# Altium schematic sheet MGNGSQ4_AC_Loopback.SchDoc
size A
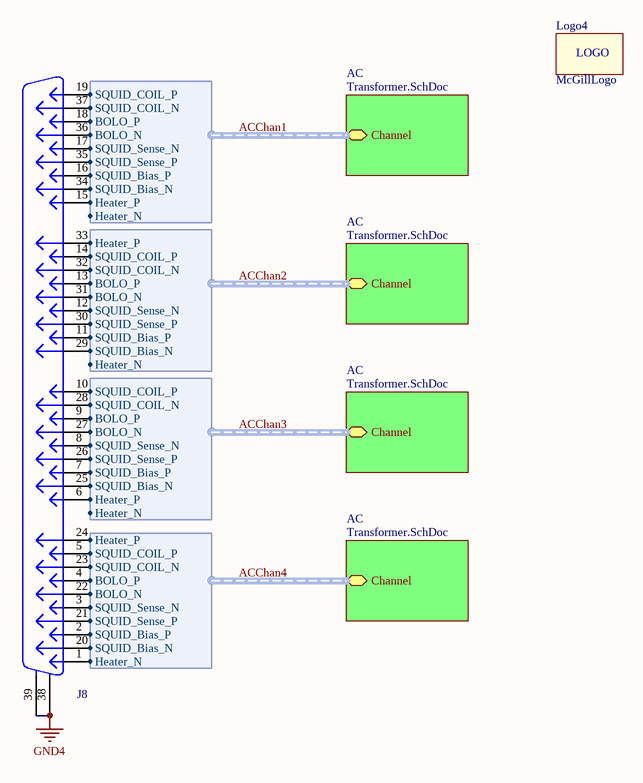
[diagram p0: MGNGSQ4_AC_Loopback.SchDoc]

## Parts
J8  DB37M  [DSUB37-M]  (value not drawn)
Logo4  McGillLogo  [McGillLogo1]  (no BOM)

## Sub-sheets
AC = Transformer.SchDoc: Channel (harness SQUID_CH_IN)
AC = Transformer.SchDoc: Channel (harness SQUID_CH_IN)
AC = Transformer.SchDoc: Channel (harness SQUID_CH_IN)
AC = Transformer.SchDoc: Channel (harness SQUID_CH_IN)

## Harnesses
SQUID_CH_IN: SQUID_COIL_P, SQUID_COIL_N, BOLO_P, BOLO_N, SQUID_Sense_P, SQUID_Bias_P, SQUID_Bias_N, Heater_P, SQUID_Sense_N, Heater_N

## Nets
GND4: J8.38(MH1) J8.39(MH2)
ACChan1.BOLO_N: J8.36 ; sheet AC/Channel.BOLO_N
ACChan1.BOLO_P: J8.18 ; sheet AC/Channel.BOLO_P
ACChan1.Heater_P: J8.15 ; sheet AC/Channel.Heater_P
ACChan1.SQUID_Bias_N: J8.34 ; sheet AC/Channel.SQUID_Bias_N
ACChan1.SQUID_Bias_P: J8.16 ; sheet AC/Channel.SQUID_Bias_P
ACChan1.SQUID_COIL_N: J8.37 ; sheet AC/Channel.SQUID_COIL_N
ACChan1.SQUID_COIL_P: J8.19 ; sheet AC/Channel.SQUID_COIL_P
ACChan1.SQUID_Sense_N: J8.17 ; sheet AC/Channel.SQUID_Sense_N
ACChan1.SQUID_Sense_P: J8.35 ; sheet AC/Channel.SQUID_Sense_P
ACChan2.BOLO_N: J8.31 ; sheet AC/Channel.BOLO_N
ACChan2.BOLO_P: J8.13 ; sheet AC/Channel.BOLO_P
ACChan2.Heater_P: J8.33 ; sheet AC/Channel.Heater_P
ACChan2.SQUID_Bias_N: J8.29 ; sheet AC/Channel.SQUID_Bias_N
ACChan2.SQUID_Bias_P: J8.11 ; sheet AC/Channel.SQUID_Bias_P
ACChan2.SQUID_COIL_N: J8.32 ; sheet AC/Channel.SQUID_COIL_N
ACChan2.SQUID_COIL_P: J8.14 ; sheet AC/Channel.SQUID_COIL_P
ACChan2.SQUID_Sense_N: J8.12 ; sheet AC/Channel.SQUID_Sense_N
ACChan2.SQUID_Sense_P: J8.30 ; sheet AC/Channel.SQUID_Sense_P
ACChan3.BOLO_N: J8.27 ; sheet AC/Channel.BOLO_N
ACChan3.BOLO_P: J8.9 ; sheet AC/Channel.BOLO_P
ACChan3.Heater_P: J8.6 ; sheet AC/Channel.Heater_P
ACChan3.SQUID_Bias_N: J8.25 ; sheet AC/Channel.SQUID_Bias_N
ACChan3.SQUID_Bias_P: J8.7 ; sheet AC/Channel.SQUID_Bias_P
ACChan3.SQUID_COIL_N: J8.28 ; sheet AC/Channel.SQUID_COIL_N
ACChan3.SQUID_COIL_P: J8.10 ; sheet AC/Channel.SQUID_COIL_P
ACChan3.SQUID_Sense_N: J8.8 ; sheet AC/Channel.SQUID_Sense_N
ACChan3.SQUID_Sense_P: J8.26 ; sheet AC/Channel.SQUID_Sense_P
ACChan4.BOLO_N: J8.22 ; sheet AC/Channel.BOLO_N
ACChan4.BOLO_P: J8.4 ; sheet AC/Channel.BOLO_P
ACChan4.Heater_N: J8.1 ; sheet AC/Channel.Heater_N
ACChan4.Heater_P: J8.24 ; sheet AC/Channel.Heater_P
ACChan4.SQUID_Bias_N: J8.20 ; sheet AC/Channel.SQUID_Bias_N
ACChan4.SQUID_Bias_P: J8.2 ; sheet AC/Channel.SQUID_Bias_P
ACChan4.SQUID_COIL_N: J8.23 ; sheet AC/Channel.SQUID_COIL_N
ACChan4.SQUID_COIL_P: J8.5 ; sheet AC/Channel.SQUID_COIL_P
ACChan4.SQUID_Sense_N: J8.3 ; sheet AC/Channel.SQUID_Sense_N
ACChan4.SQUID_Sense_P: J8.21 ; sheet AC/Channel.SQUID_Sense_P

## Buses and harness runs
harness ACChan1 = sheet AC/Channel
harness ACChan2 = sheet AC/Channel
harness ACChan3 = sheet AC/Channel
harness ACChan4 = sheet AC/Channel

## Notes on the sheet
- (in symbol Logo) LOGO

## Library data of the parts
J8 = DB37M: Manufacturer: Norcomp; Part Constraints: 182-037-113R531; Assembly Comments: none; Cost: $4.32; Manufacturer Part Number: 182-037-113R531; Supplier: Digikey; Supplier Part Number: 182-37ME-ND; Value: DB37M; Type: thru-hole
Logo4 = Logo: Silkscreen Logo; Manufacturer: McGill; Assembly Comments: none; Value: McGillLogo; Cost: $0; Type: SMD